# Altium schematic sheet MLX Sensor.SchDoc
size A; SheetNumber: 11; SheetTotal: 14
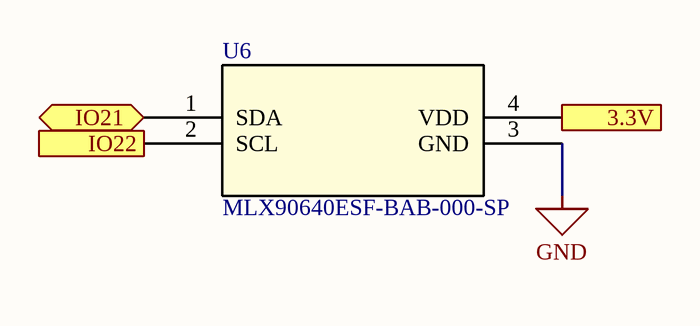
[diagram p0: MLX Sensor.SchDoc]

## Parts
U6  MLX90640ESF-BAB-000-SP  [MLX90640_MEL]

## Ports
3.3V (in, see ESP32[4C], Ecternal I2C[2B], Navigation switches[2B], Programming Circuit[2B], Regulator 3.3V[3A], SD card[3B]), IO21 (bidir, see ESP32[3C], Ecternal I2C[2B]), IO22 (in, see ESP32[3C], Ecternal I2C[2B])

## Nets
GND: U6.3(GND)
3.3V: U6.4(VDD) ; port 3.3V
IO21: U6.1(SDA) ; port IO21
IO22: U6.2(SCL) ; port IO22

## Library data of the parts
U6 = MLX90640ESF-BAB-000-SP: No Description Available; Mfr_Name: Melexis; RefDes: RefDes; Type: Type